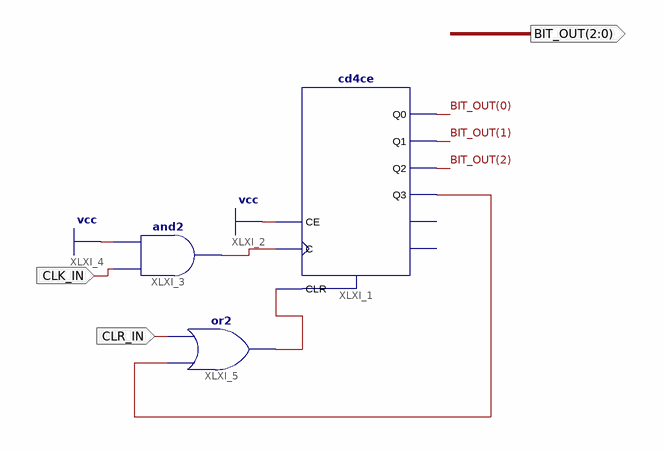
[diagram p0: schematic sheet 1]
// Xilinx ISE schematic Counter0_7.sch (spartan6) as structural Verilog: 3 symbols, 3 ports
module Counter0_7 (
  input  CLK_IN,
  input  CLR_IN,
  output [2:0] BIT_OUT
);

  wire XLXN_8, XLXN_11, XLXN_14;

  cd4ce XLXI_1 (
    .C(XLXN_8), .CE(1'b1), .CLR(XLXN_11), .Q0(BIT_OUT[0]), .Q1(BIT_OUT[1]), .Q2(BIT_OUT[2]), .Q3(XLXN_14));  // open: CEO, TC
  and XLXI_3 (XLXN_8, CLK_IN, 1'b1);
  or XLXI_5 (XLXN_11, XLXN_14, CLR_IN);
endmodule
